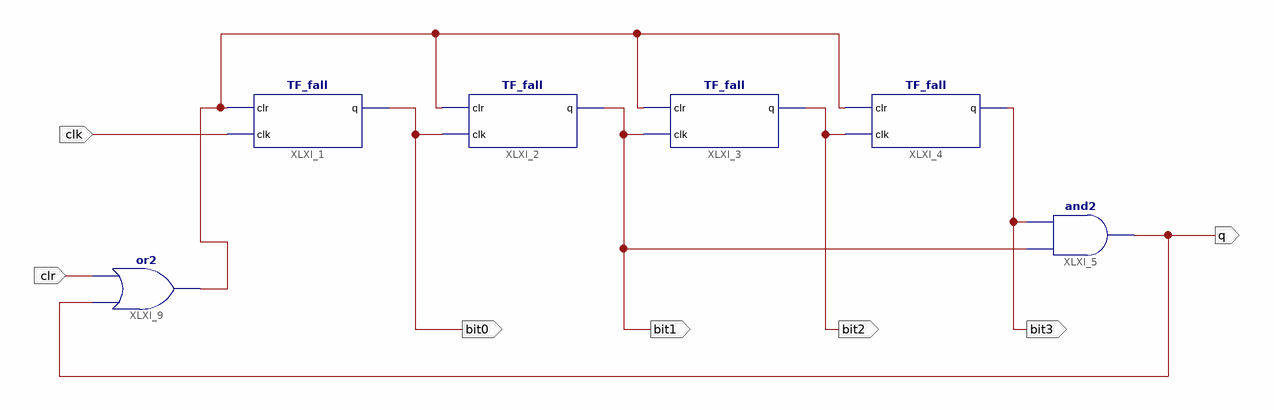
[diagram p0: schematic sheet 1]
// Xilinx ISE schematic counter0_9.sch (spartan6) as structural Verilog: 6 symbols, 7 ports
module counter0_9 (
  input  clk,
  input  clr,
  output bit0,
  output bit1,
  output bit2,
  output bit3,
  output q
);

  wire XLXN_12;

  TF_fall XLXI_1 (.clr(XLXN_12), .clk(clk), .q(bit0));
  TF_fall XLXI_2 (.clr(XLXN_12), .clk(bit0), .q(bit1));
  TF_fall XLXI_3 (.clr(XLXN_12), .clk(bit1), .q(bit2));
  TF_fall XLXI_4 (.clr(XLXN_12), .clk(bit2), .q(bit3));
  and XLXI_5 (q, bit1, bit3);
  or XLXI_9 (XLXN_12, q, clr);
endmodule
